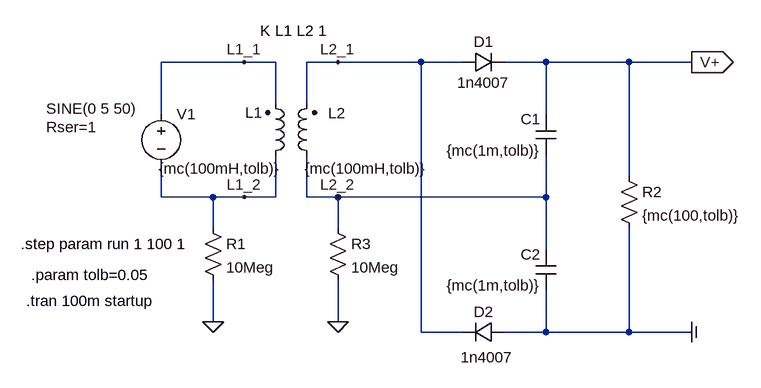
[diagram p0: schematic monte_carlo.asc]
monte_carlo.asc, the LTspice schematic file:
Version 4
SHEET 1 1276 680
WIRE 96 16 -32 16
WIRE 144 16 96 16
WIRE 240 16 192 16
WIRE 368 16 240 16
WIRE 432 16 368 16
WIRE 560 16 496 16
WIRE 688 16 560 16
WIRE 784 16 688 16
WIRE 144 80 144 16
WIRE 192 80 192 16
WIRE -32 96 -32 16
WIRE 560 96 560 16
WIRE 688 192 688 16
WIRE -32 224 -32 176
WIRE 48 224 -32 224
WIRE 96 224 48 224
WIRE 144 224 144 160
WIRE 144 224 96 224
WIRE 192 224 192 160
WIRE 240 224 192 224
WIRE 560 224 560 160
WIRE 560 224 240 224
WIRE 48 272 48 224
WIRE 240 272 240 224
WIRE 560 304 560 224
WIRE 48 416 48 352
WIRE 240 416 240 352
WIRE 368 432 368 16
WIRE 432 432 368 432
WIRE 560 432 560 368
WIRE 560 432 496 432
WIRE 688 432 688 272
WIRE 688 432 560 432
WIRE 784 432 688 432
FLAG 48 416 0
FLAG 784 432 COM
IOPIN 784 432 Out
FLAG 240 416 0
FLAG 784 16 V+
IOPIN 784 16 Out
FLAG 240 16 L2_1
FLAG 240 224 L2_2
FLAG 96 16 L1_1
FLAG 96 224 L1_2
SYMBOL voltage -32 80 R0
WINDOW 123 0 0 Left 2
WINDOW 39 -177 36 Left 2
WINDOW 3 -177 8 Left 2
SYMATTR SpiceLine Rser=1
SYMATTR Value SINE(0 5 50)
SYMATTR InstName V1
SYMBOL ind2 128 176 M180
WINDOW 0 -31 82 Left 2
WINDOW 3 -164 -4 Left 2
SYMATTR InstName L1
SYMATTR Value {mc(100mH,tolb)}
SYMATTR Type ind
SYMBOL ind2 208 176 R180
WINDOW 0 -44 81 Left 2
WINDOW 3 -170 -4 Left 2
SYMATTR InstName L2
SYMATTR Value {mc(100mH,tolb)}
SYMATTR Type ind
SYMBOL res 672 176 R0
SYMATTR InstName R2
SYMATTR Value {mc(100,tolb)}
SYMBOL cap 576 160 R180
WINDOW 0 24 56 Left 2
WINDOW 3 24 8 Left 2
SYMATTR InstName C1
SYMATTR Value {mc(1m,tolb)}
SYMBOL cap 576 368 R180
WINDOW 0 24 56 Left 2
WINDOW 3 24 8 Left 2
SYMATTR InstName C2
SYMATTR Value {mc(1m,tolb)}
SYMBOL res 32 256 R0
SYMATTR InstName R1
SYMATTR Value 10Meg
SYMBOL diode 432 32 R270
WINDOW 0 32 32 VTop 2
WINDOW 3 0 32 VBottom 2
SYMATTR InstName D1
SYMATTR Value 1n4007
SYMBOL diode 496 416 R90
WINDOW 0 0 32 VBottom 2
WINDOW 3 39 27 VTop 2
SYMATTR InstName D2
SYMATTR Value 1n4007
SYMBOL res 224 256 R0
SYMATTR InstName R3
SYMATTR Value 10Meg
TEXT 120 -32 Left 2 !K L1 L2 1
TEXT -240 384 Left 2 !.tran 100m startup
TEXT -232 344 Left 2 !.param tolb=0.05
TEXT -248 296 Left 2 !.step param run 1 100 1

The netlist it stands for:
* monte_carlo.asc
V1 L1_1 L1_2 SINE(0 5 50) Rser=1
L1 L1_2 L1_1 {mc(100mH,tolb)}
L2 L2_2 L2_1 {mc(100mH,tolb)}
R2 V+ COM {mc(100,tolb)}
C1 L2_2 V+ {mc(1m,tolb)}
C2 COM L2_2 {mc(1m,tolb)}
R1 L1_2 0 10Meg
D1 L2_1 V+ 1n4007
D2 COM L2_1 1n4007
R3 L2_2 0 10Meg
.model D D
.lib standard.dio
K L1 L2 1
.tran 100m startup
.param tolb=0.05
.step param run 1 100 1
.backanno
.end